# EasyEDA Pro project ProDoc_esp32_DWM1000_2025-11-09.epro

# Schematic Schematic1
Board Name: esp32_DWM1000; Create Date: 2025-10-17; Page Name: P1; Project Name: UWB; Schematic Name: Schematic1; Update Date: 2025-10-17; Company: EasyEDA.com; Page Size: A4; Version: V1.0
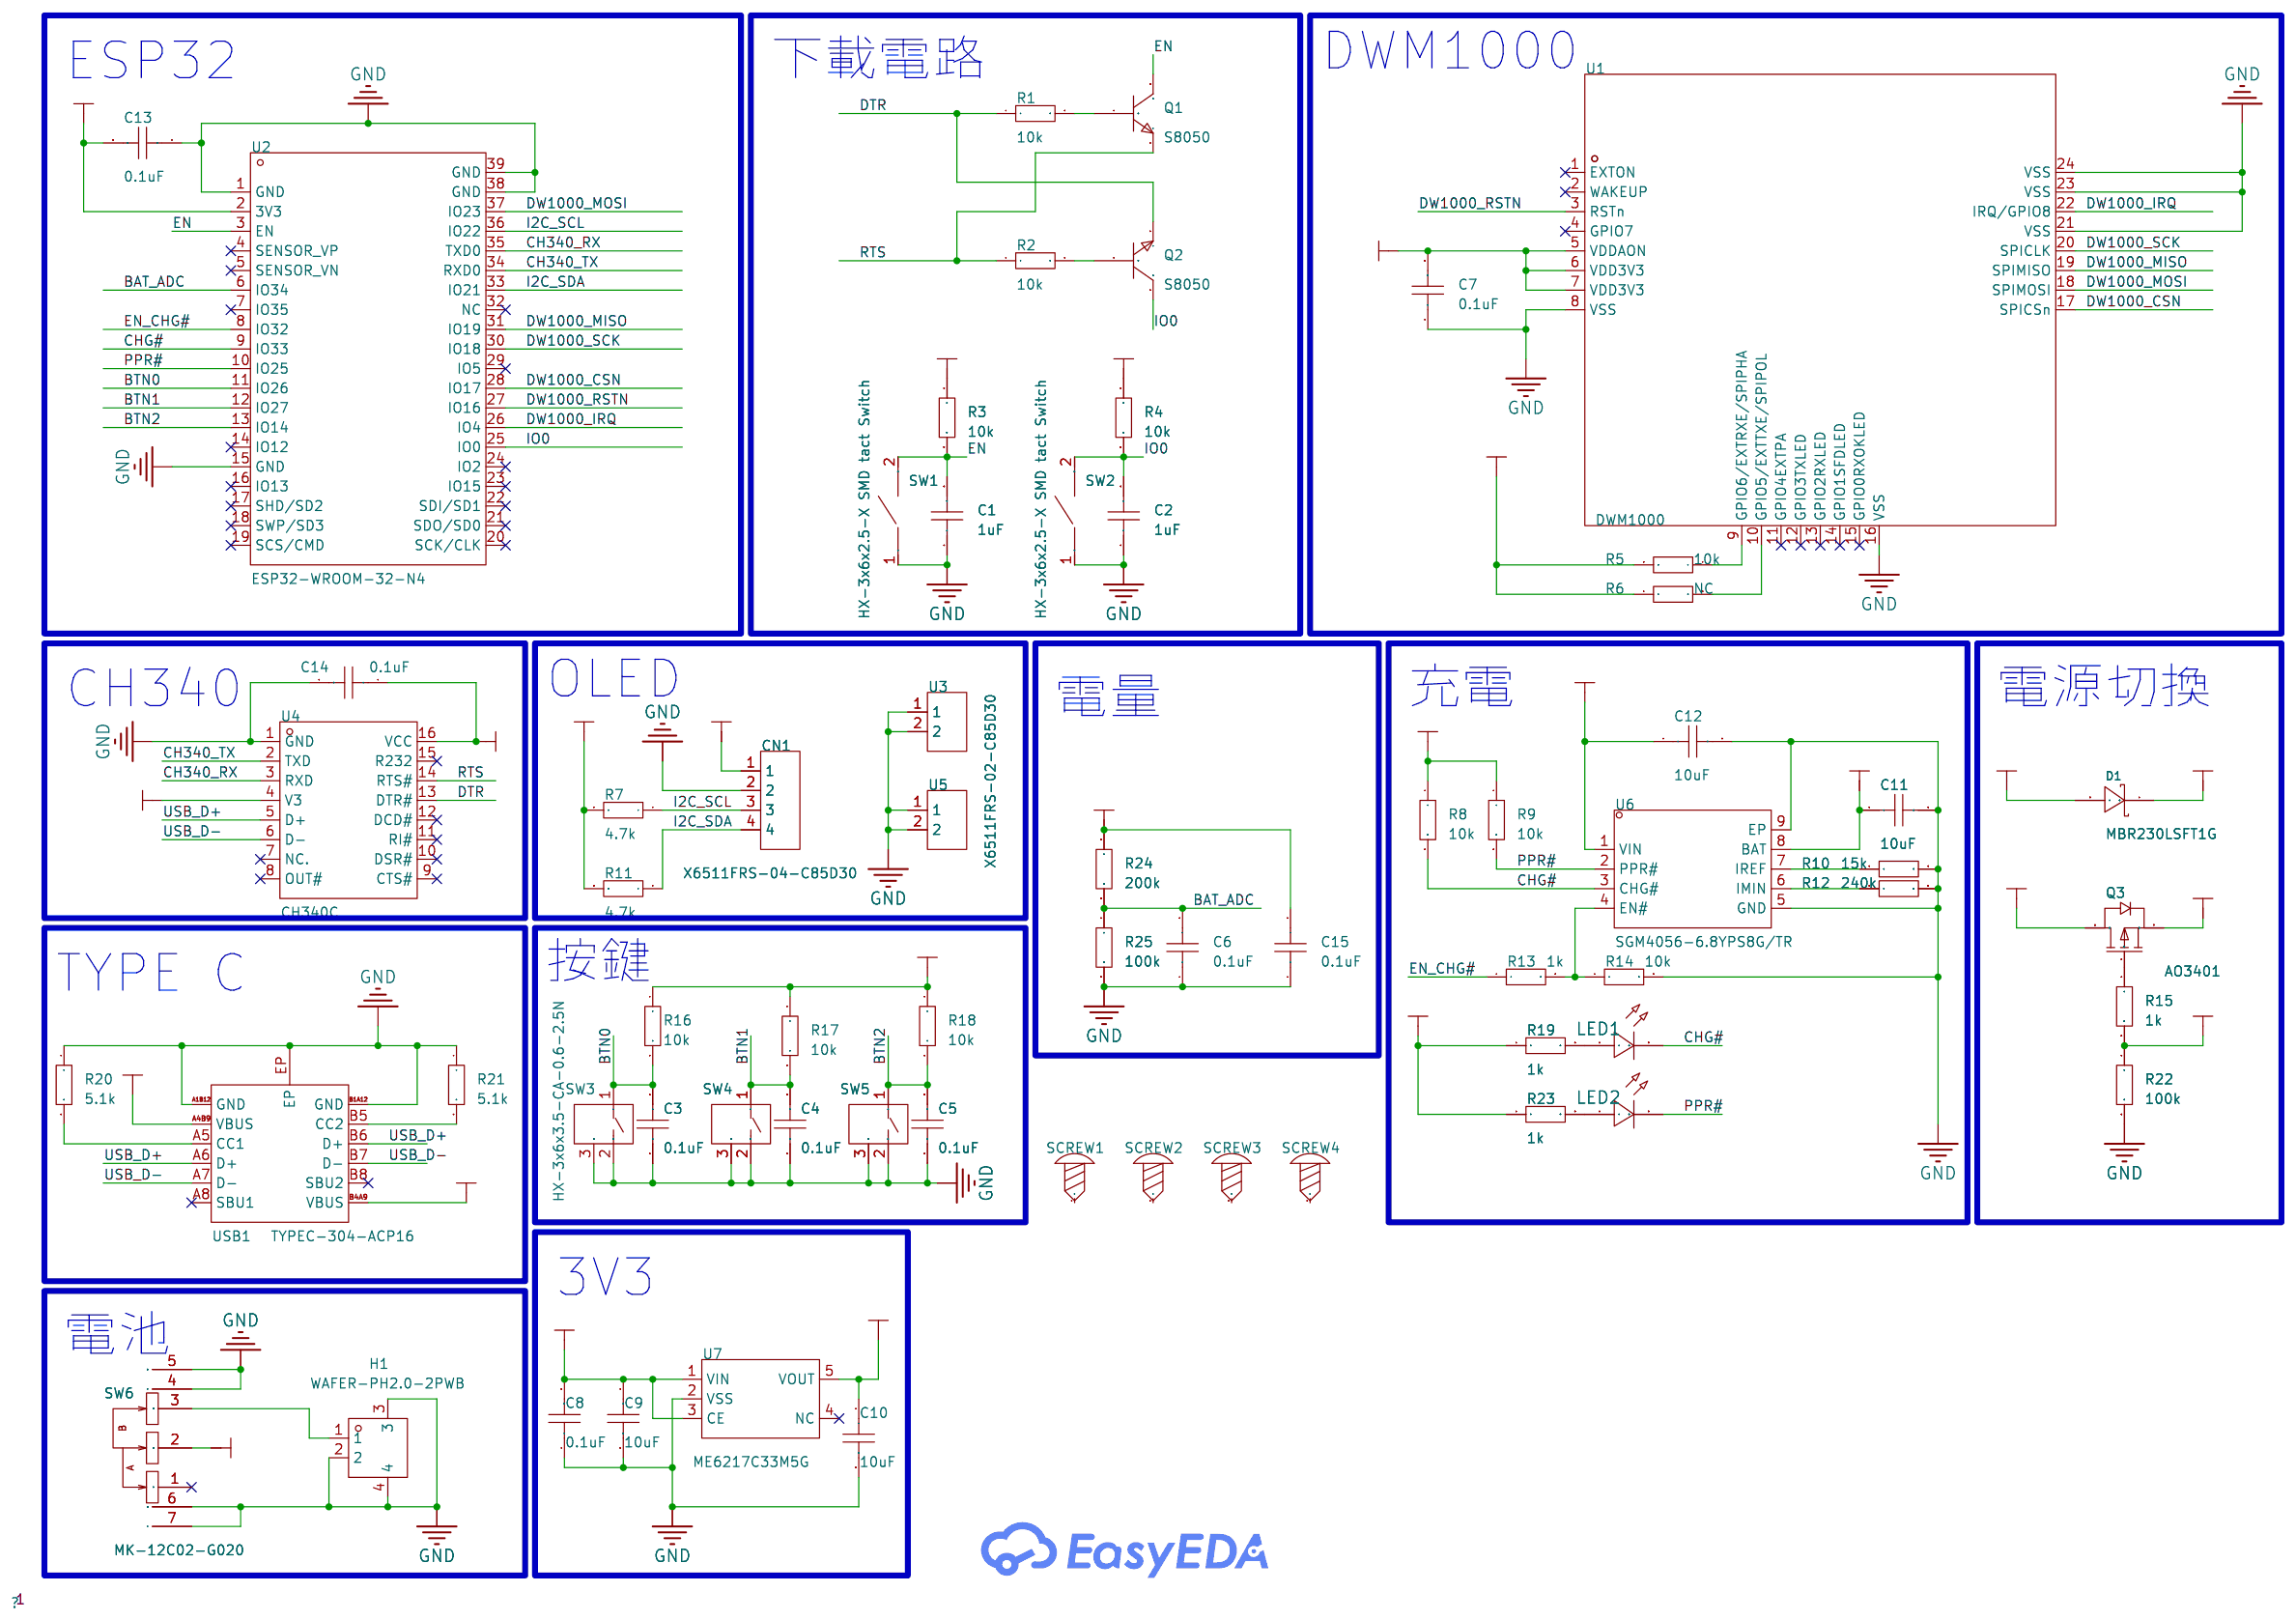
[diagram p0: schematic sheet]

## Parts
C1  1uF  [C0805]
C2  1uF  [C0805]
C3  0.1uF  [C0805]
C4  0.1uF  [C0805]
C5  0.1uF  [C0805]
C6  0.1uF  [C0805]
C7  0.1uF  [C0805]
C8  0.1uF  [C0805]
C9  10uF  [C0805]
C10  10uF  [C0805]
C11  10uF  [C0805]
C12  10uF  [C0805]
C13  0.1uF  [C0805]
C14  0.1uF  [C0805]
C15  0.1uF  [C0805]
CN1  X6511FRS-04-C85D30  [HDR-SMD_4P-P2.54-H-F]
D1  MBR230LSFT1G  [SOD-123FL_L2.7-W1.8-LS3.8-RD]
H1  WAFER-PH2.0-2PWB  [CONN-SMD_2P-P2.00_XUNPU_WAFER-PH2.0-2PWB]
LED1  -  [LED0805-RD_GREEN]
LED2  -  [LED0805-RD_GREEN]
Q1  S8050  [SOT-23-3_L2.9-W1.3-P1.90-LS2.4-BR]
Q2  S8050  [SOT-23-3_L2.9-W1.3-P1.90-LS2.4-BR]
Q3  AO3401  [SOT-23-3_L2.9-W1.6-P1.90-LS2.8-BR]
R1  10k  [R0805]
R2  10k  [R0805]
R3  10k  [R0805]
R4  10k  [R0805]
R5  10k  [R0805]
R6  NC  [R0805]
R7  4.7k  [R0805]
R8  10k  [R0805]
R9  10k  [R0805]
R10  15k  [R0805]
R11  4.7k  [R0805]
R12  240k  [R0805]
R13  1k  [R0805]
R14  10k  [R0805]
R15  1k  [R0805]
R16  10k  [R0805]
R17  10k  [R0805]
R18  10k  [R0805]
R19  1k  [R0805]
R20  5.1k  [R0805]
R21  5.1k  [R0805]
R22  100k  [R0805]
R23  1k  [R0805]
R24  200k  [R0805]
R25  100k  [R0805]
SCREW1  -  [Screw-Hole-M3]
SCREW2  -  [Screw-Hole-M3]
SCREW3  -  [Screw-Hole-M3]
SCREW4  -  [Screw-Hole-M3]
SW1  HX-3x6x2.5-X SMD tact Switch  [SW-SMD_HX-3X6X2.5-X]
SW2  HX-3x6x2.5-X SMD tact Switch  [SW-SMD_HX-3X6X2.5-X]
SW3  HX-3x6x3.5-CA-0.6-2.5N  [SW-SMD_HX-3X6X3.5-CA-0.6-2.5N]
SW4  HX-3x6x3.5-CA-0.6-2.5N  [SW-SMD_HX-3X6X3.5-CA-0.6-2.5N]
SW5  HX-3x6x3.5-CA-0.6-2.5N  [SW-SMD_HX-3X6X3.5-CA-0.6-2.5N]
SW6  MK-12C02-G020  [SW-SMD_MK-12C02-G020]
U1  DWM1000  [WIRELM-TH_DWM1000]
U2  ESP32-WROOM-32-N4  [WIFIM-SMD_ESP32-WROOM-32-N4]
U3  X6511FRS-02-C85D30  [HDR-SMD_2P-P2.54-H-F-L11.5]
U4  CH340C  [SOP-16_L10.0-W3.9-P1.27-LS6.0-BL]
U5  X6511FRS-02-C85D30  [HDR-SMD_2P-P2.54-H-F-L11.5]
U6  SGM4056-6.8YPS8G/TR  [SOIC-8_L4.9-W3.9-P1.27-LS6.0-BL-EP]
U7  ME6217C33M5G  [SOT-23-5_L3.0-W1.7-P0.95-LS2.8-BR]
USB1  TYPEC-304-ACP16  [USB-C-SMD_TYPE-C-16P-1]

## Library data of the parts
C1-C15 = CAP_0805: Supplier Footprint: 0805
CN1 = X6511FRS-04-C85D30: Holes Structure:1x4P Pitch:2.54mm Circular Hole / Square Hole:Square Hole Mounting Type:Surface Mount, Right Angle Number of Rows:1 Number of Positions:4P Current Rating:3A Holes Direction:Side Insulation Height:8.5mm Operating Temperature:-40℃~+105℃ Oper; LCSC Part Name: 1x4P 间距:2.54mm 卧贴; Supplier Part: C5142237; Manufacturer: XKB Connection(中国星坤); Supplier Footprint: SMD,P=2.54mm,卧贴; JLCPCB Part Class: Extended Part; Datasheet: https://item.szlcsc.com/datasheet/X6511FRS-04-C85D30/5758581.html; Supplier: LCSC; Holes Structure: 1x4P; Pitch: 2.54mm; Circular Hole / Square Hole: Square Hole; Mounting Type: Surface Mount, Right Angle; Number of Rows: 1; Number of Positions: 4P; Current Rating: 3A; Holes Direction: Side; Insulation Height: 8.5mm; Operating Temperature: -40℃~+105℃
D1 = MBR230LSFT1G: Voltage - Forward(Vf@If):430mV@2A Voltage - DC Reverse(Vr):30V Current - Rectified:2A Reverse Leakage Current (Ir):1mA@30V Operating Junction Temperature Range:-55℃~+125℃ Operating Junction Temperature Range:-55℃~+125℃ Non-Repetitive Peak Forward Surge Cu; LCSC Part Name: 电压:30V 电流:2A; Supplier Part: C126673; Manufacturer: onsemi(安森美); Supplier Footprint: SOD-123FL; JLCPCB Part Class: 扩展库; Datasheet: https://item.szlcsc.com/datasheet/MBR230LSFT1G/137953.html; Supplier: LCSC; Voltage - Forward(Vf@If): 430mV@2A; Voltage - DC Reverse(Vr): 30V; Current - Rectified: 2A; Reverse Leakage Current (Ir): 1mA@30V; Operating Junction Temperature Range: -55℃~+125℃; Non-Repetitive Peak Forward Surge Current: 40A
H1 = WAFER-PH2.0-2PWB: Pins Structure:1x2P Pitch:2mm Mounting Type:Surface Mount, Right Angle Reference Series:PH Number of Pins:2P Number of Rows:1 Number of PINs Per Row:2 Row Spacing:- Current Rating:2A Contact Material:Brass Contact Plating:Tin Operating Temperature:-25℃~+8; LCSC Part Name: 1x2P 间距:2mm 卧贴 系列:PH; Supplier Part: C3029440; Manufacturer: XUNPU(讯普); Supplier Footprint: SMD,P=2mm,卧贴; JLCPCB Part Class: 扩展库; Datasheet: https://item.szlcsc.com/datasheet/WAFER-PH2.0-2PWB/3561452.html; Supplier: LCSC; Pins Structure: 1x2P; Pitch: 2mm; Mounting Type: Surface Mount, Right Angle; Reference Series: PH; Number of Pins: 2P; Number of Rows: 1; Number of PINs Per Row: 2; Current Rating: 2A; Contact Material: Brass; Contact Plating: Tin; Operating Temperature: -25℃~+85℃; Voltage Rating: 250V; Plastic Material: LCP; Supplementary Features: Auxiliary Solder Pin; Color: Beige; Z-Height of the Board: 5.6mm; X-Length of Bottom Edge on Board (Spacing Line): 8mm; Y-Width of Bottom Edge on Board: 7.59mm
LED1 LED2 = LED_0805-R: Supplier Footprint: 0805
Q1 Q2 = S8050: Transistor Type: Collector Current (Ic): Collector-Emitter Breakdown Voltage (Vceo): Power Dissipation (Pd):; LCSC Part Name: 耐压:25V 电流:500mA NPN; Supplier Part: C139514; Supplier Footprint: SOT-23; JLCPCB Part Class: 扩展库; Datasheet: https://atta.szlcsc.com/upload/public/pdf/source/20171116/C139514_15108221321741123744.pdf; Supplier: LCSC
Q3 = AO3401: Type:1 Piece P-Channel Drain Source Voltage (Vdss): Continuous Drain Current (Id): Drain Source On Resistance (RDS(on)@Vgs,Id):60mΩ@10V,4.2A Power Dissipation (Pd): Gate Threshold Voltage (Vgs(th)@Id): Input Capacitance (Ciss@Vds):957pF@15V Reverse Transf; LCSC Part Name: P沟道,电流:-4.2A,耐压:-30V 停产; Supplier Part: C305433; Manufacturer: BLUE ROCKET(蓝箭); Supplier Footprint: SOT-23; JLCPCB Part Class: 扩展库; Datasheet: https://atta.szlcsc.com/upload/public/pdf/source/20190731/C305433_82C324880901F9A45014693AEB96B6E3.pdf; Supplier: LCSC; Type: 1 Piece P-Channel; Drain Source On Resistance (RDS(on)@Vgs,Id): 60mΩ@10V,4.2A; Input Capacitance (Ciss@Vds): 957pF@15V; Reverse Transfer Capacitance (Crss@Vds): 77pF@15V; Operating Temperature: -55℃~+150℃
R1 R2 R5-R13 R15 R19-R25 = SCR0805F10K: Type:Thick Film Resistor Resistance:10kΩ Tolerance:±1% Tolerance:±1% Power(Watts):125mW Voltage-Supply(Max):150V Operating Temperature:-55℃~+155℃ Operating Temperature:-55℃~+155℃; LCSC Part Name: 厚膜电阻 10kΩ ±1% 125mW; Supplier Part: C3016734; Manufacturer: VO(翔胜); Supplier Footprint: 0805; JLCPCB Part Class: Extended Part; Datasheet: https://atta.szlcsc.com/upload/public/pdf/source/20220513/247AF9639BA21CF93567DC289CCC6A22.pdf; Supplier: LCSC; Type: Thick Film Resistor; Tolerance: ±1%; Power(Watts): 125mW; Voltage-Supply(Max): 150V; Operating Temperature: -55℃~+155℃
R3 R4 R14 R16-R18 = Res_0603: Supplier Footprint: 0603
SCREW1-SCREW4 = Screw-Hole-M3: Supplier Footprint: 插件
SW1 SW2 = HX-3x6x2.5-X SMD tact Switch: LCSC Part Name: 6*3.5*2.5mm 立贴 轻触开关; Supplier Part: C49234125; Manufacturer: hanxia(韩下); Supplier Footprint: SMD; JLCPCB Part Class: 扩展库; Datasheet: https://atta.szlcsc.com/upload/public/pdf/source/20250618/952D7CCB54265932C14FA2108DB7C7AE.pdf; Supplier: LCSC
SW3-SW5 = HX-3x6x3.5-CA-0.6-2.5N: Circuit:SPST Actuator Style:- Operating Force:2.5N Mounting Type:Surface Mount, Right Angle Length:7mm Width:3.55mm Switch Height:3.5mm with Bracket:Without Bracket Contact Current:50mA Voltage Rating:12V Actuator/Cap Color:Black With Lamp:No IP Rating:-; LCSC Part Name: 7.7*3.5*3.5mm 卧贴 轻触开关; Supplier Part: C49234146; Manufacturer: hanxia(韩下); Supplier Footprint: SMD,7x3.6mm; JLCPCB Part Class: 扩展库; Datasheet: https://item.szlcsc.com/datasheet/HX-3x6x3.5-CA-0.6-2.5N/51650207.html; Supplier: LCSC; Circuit: SPST; Operating Force: 2.5N; Mounting Type: Surface Mount, Right Angle; Length: 7mm; Width: 3.55mm; Switch Height: 3.5mm; with Bracket: Without Bracket; Contact Current: 50mA; Voltage Rating: 12V; Actuator/Cap Color: Black; With Lamp: No; Termination Style: SMD(SMT) Tab; Life: 20,000 Cycles
SW6 = MK-12C02-G020: Circuit:SPDT Actuator Style:Rectangular Columnar Termination Style:- Length:6.6mm Width:1.4mm Switch Height:4.7mm Mounting Type:Surface Mount, Right Angle Actuator Color:Black Current Rating:1A Voltage Rating:6V Life:10,000 Cycles Operating Temperature:-2; LCSC Part Name: 微型拨动开关; Supplier Part: C963206; Manufacturer: G-Switch(品赞); Supplier Footprint: SMD,6.6x1.4mm; Datasheet: https://item.szlcsc.com/datasheet/MK-12C02-G020/1046841.html; Supplier: LCSC; Circuit: SPDT; Actuator Style: Rectangular Columnar; Length: 6.6mm; Width: 1.4mm; Switch Height: 4.7mm; Mounting Type: Surface Mount, Right Angle; Actuator Color: Black; Current Rating: 1A; Voltage Rating: 6V; Life: 10,000 Cycles; Operating Temperature: -20℃~+70℃
U1 = DWM1000: Supplier Part: C95238; Manufacturer: decaWave; Supplier Footprint: SMD; JLCPCB Part Class: 扩展库; Datasheet: https://atta.szlcsc.com/upload/public/pdf/source/20170217/1487301595210.pdf; Supplier: LCSC
U2 = ESP32-WROOM-32-N4: LCSC Part Name: WiFi+蓝牙4.2+双核CPU模块; Supplier Part: C82899; Manufacturer: ESPRESSIF(乐鑫); Supplier Footprint: SMD,25.5x18mm; JLCPCB Part Class: 扩展库; Datasheet: https://item.szlcsc.com/datasheet/ESP32-WROOM-32-N4/84060.html; Supplier: LCSC
U3 U5 = X6511FRS-02-C85D30: Holes Structure:1x2P Pitch:2.54mm Circular Hole / Square Hole:Square Hole Mounting Type:Surface Mount, Right Angle Number of Rows:1 Number of Positions:2P Current Rating:3A Holes Direction:Side Insulation Height:8.5mm Operating Temperature:-40℃~+105℃ Oper; LCSC Part Name: 1x2P 间距:2.54mm 卧贴; Supplier Part: C5142235; Manufacturer: XKB Connection(中国星坤); Supplier Footprint: SMD,P=2.54mm,卧贴; JLCPCB Part Class: 扩展库; Datasheet: https://item.szlcsc.com/datasheet/X6511FRS-02-C85D30/5758579.html; Supplier: LCSC; Holes Structure: 1x2P; Pitch: 2.54mm; Circular Hole / Square Hole: Square Hole; Mounting Type: Surface Mount, Right Angle; Number of Rows: 1; Number of Positions: 2P; Current Rating: 3A; Holes Direction: Side; Insulation Height: 8.5mm; Operating Temperature: -40℃~+105℃
U4 = CH340C: Applications Function:Transceiver USB Protocol:USB 2.0 Voltage - Supply:3.3V；5V Voltage - Supply:3.3V；5V Data Rate:2Mbps Operating Temperature:-20℃~+70℃ Operating Temperature:-20℃~+70℃ Current - Supply:7mA Supply Current (Iq):50uA; LCSC Part Name: USB转串口芯片; Supplier Part: C84681; Manufacturer: WCH(南京沁恒); Supplier Footprint: SOP-16; Datasheet: https://item.szlcsc.com/datasheet/CH340C/85852.html; Supplier: LCSC; Applications Function: Transceiver; USB Protocol: USB 2.0; Voltage - Supply: 3.3V；5V; Data Rate: 2Mbps; Operating Temperature: -20℃~+70℃; Current - Supply: 7mA; Supply Current (Iq): 50uA
U6 = SGM4056-6.8YPS8G/TR: Supplier Part: C79687; Manufacturer: SGMICRO(圣邦微); Supplier Footprint: SOIC-8-EP; JLCPCB Part Class: 扩展库; Datasheet: https://atta.szlcsc.com/upload/public/pdf/source/20170908/C79687_1504870102874958054.pdf; Supplier: LCSC
U7 = ME6217C33M5G: Output Type:Fixed Voltage - Supply:6.5V Output Voltage:3.3V Output Voltage:3.3V Output Current:800mA Power Supply Rejection Ratio (PSRR):65dB@(1kHz) Voltage Dropout:180mV@(300mA) standby current:100uA Features:Over Temperature Protection；Enable Operating; LCSC Part Name: 输入7V 输出3.3V 800mA; Supplier Part: C427602; Manufacturer: MICRONE(南京微盟); Supplier Footprint: SOT-23-5; Datasheet: https://item.szlcsc.com/datasheet/ME6217C33M5G/421842.html; Supplier: LCSC; Output Type: Fixed; Voltage - Supply: 6.5V; Output Voltage: 3.3V; Output Current: 800mA; Power Supply Rejection Ratio (PSRR): 65dB@(1kHz); Voltage Dropout: 180mV@(300mA); standby current: 100uA; Features: Over Temperature Protection；Enable; Operating Temperature: -40℃~+85℃; Output Configuration: Positive; Number of Outputs: 1
USB1 = TYPEC-304-ACP16: Connector Type:Type-C Standard:- Gender:Female Number of Ports:1 Number of Contacts:16P Mounting Style:卧贴 Current Rating - Power (Max):3A Contact Material:Copper Contact Plating:Gold Operating Temperature Range:-40℃~+85℃ Operating Temperature Range:-40℃~+; LCSC Part Name: Type-C 母 卧贴; Supplier Part: C2982555; Manufacturer: XUNPU(讯普); Supplier Footprint: SMD; Datasheet: https://atta.szlcsc.com/upload/public/pdf/source/20220311/3C907F75E12F45E4EE7F73565AB9C294.pdf; Supplier: LCSC; Connector Type: Type-C; Gender: Female; Number of Ports: 1; Number of Contacts: 16P; Mounting Style: 卧贴; Current Rating - Power (Max): 3A; Contact Material: Copper; Contact Plating: Gold; Operating Temperature Range: -40℃~+85℃

## Nets
3V3: C7.2 C10.1 C13.2 C14.1 CN1.1 R3.1 R4.1 R5.2 R6.1 R7.2 R8.1 R9.1 R11.2 R16.1 R17.1 R18.1 R19.1 R23.1 U1.5(VDDAON) U1.6(VDD3V3) U1.7(VDD3V3) U2.2(3V3) U4.4(V3) U4.16(VCC) U7.5(VOUT)
5V: C12.1 D1.2(A) R15.2 R22.1 U6.1(VIN) USB1.A4B9(VBUS) USB1.B4A9(VBUS)
GND: C1.1 C2.1 C3.1 C4.1 C5.1 C6.1 C7.1 C8.1 C9.2 C10.2 C11.2 C12.2 C13.1 C14.2 C15.1 CN1.2 H1.2 H1.3 H1.4 R10.2 R12.2 R14.2 R20.1 R21.1 R22.2 R25.2 SW1.1 SW2.1 SW3.2 SW3.3 SW4.2 SW4.3 SW5.2 SW5.3 SW6.4 SW6.5 SW6.6 SW6.7 U1.8(VSS) U1.16(VSS) U1.21(VSS) U1.23(VSS) U1.24(VSS) U2.1(GND) U2.15(GND) U2.38(GND) U2.39(GND) U3.1 U3.2 U4.1(GND) U5.1 U5.2 U6.5(GND) U6.9(EP) U7.2(VSS) USB1.A1B12(GND) USB1.B1A12(GND) USB1.EP
VBAT: C11.1 C15.2 Q3.3(D) R24.1 SW6.2 U6.8(BAT)
BAT_ADC: C6.2 R24.2 R25.1 U2.6(IO34)
BTN0: C3.2 R16.2 SW3.1 U2.11(IO26)
BTN1: C4.2 R17.2 SW4.1 U2.12(IO27)
BTN2: C5.2 R18.2 SW5.1 U2.13(IO14)
CH340_RX: U2.35(TXD0) U4.3(RXD)
CH340_TX: U2.34(RXD0) U4.2(TXD)
CHG#: LED1.2(C) R8.2 U2.9(IO33) U6.3(CHG#)
DTR: Q2.2(E) R1.1 U4.13(DTR#)
DW1000_CSN: U1.17(SPICSn) U2.28(IO17)
DW1000_IRQ: U1.22(IRQ/GPIO8) U2.26(IO4)
DW1000_MISO: U1.19(SPIMISO) U2.31(IO19)
DW1000_MOSI: U1.18(SPIMOSI) U2.37(IO23)
DW1000_RSTN: U1.3(RSTn) U2.27(IO16)
DW1000_SCK: U1.20(SPICLK) U2.30(IO18)
EN: C1.2 Q1.3(C) R3.2 SW1.2 U2.3(EN)
EN_CHG#: R13.1 U2.8(IO32)
I2C_SCL: CN1.3 R7.1 U2.36(IO22)
I2C_SDA: CN1.4 R11.1 U2.33(IO21)
IO0: C2.2 Q2.3(C) R4.2 SW2.2 U2.25(IO0)
PPR#: LED2.2(C) R9.2 U2.10(IO25) U6.2(PPR#)
RTS: Q1.2(E) R2.1 U4.14(RTS#)
USB_D+: U4.5(D+) USB1.A6(D+) USB1.B6(D+)
USB_D-: U4.6(D-) USB1.A7(D-) USB1.B7(D-)
VSYS: C8.2 C9.1 D1.1(C) Q3.2(S) U7.1(VIN) U7.3(CE)
$1N1272: Q1.1(B) R1.2
$1N1274: Q2.1(B) R2.2
$1N2137: R20.2 USB1.A5(CC1)
$1N2147: R21.2 USB1.B5(CC2)
$1N2753: R5.1 U1.9(GPIO6/EXTRXE/SPIPHA)
$1N2758: R6.2 U1.10(GPIO5/EXTTXE/SPIPOL)
$1N3652: Q3.1(G) R15.1
$1N4219: R10.1 U6.7(IREF)
$1N4263: R12.1 U6.6(IMIN)
$1N4572: LED2.1(A) R23.2
$1N4597: LED1.1(A) R19.2
$1N4717: R13.2 R14.1 U6.4(EN#)
$1N5038: H1.1 SW6.3

Not connected (* = marked no-connect by the designer): SCREW1 1; SCREW2 1; SCREW3 1; SCREW4 1; SW6 1*; U1 1(EXTON)* 2(WAKEUP)* 4(GPIO7)* 11(GPIO4EXTPA)* 12(GPIO3TXLED)* 13(GPIO2RXLED)* 14(GPIO1SFDLED)* 15(GPIO0RXOKLED)*; U2 4(SENSOR_VP)* 5(SENSOR_VN)* 7(IO35)* 14(IO12)* 16(IO13)* 17(SHD/SD2)* 18(SWP/SD3)* 19(SCS/CMD)* 20(SCK/CLK)* 21(SDO/SD0)* 22(SDI/SD1)* 23(IO15)* 24(IO2)* 29(IO5)* 32(NC)*; U4 7(NC.)* 8(OUT#)* 9(CTS#)* 10(DSR#)* 11(RI#)* 12(DCD#)* 15(R232)*; U7 4(NC)*; USB1 A8(SBU1)* B8(SBU2)*

## Notes on the sheet
- ESP32
- 下載電路
- DWM1000
- CH340
- OLED
- 電量
- 充電
- 電源切換
- TYPE C
- 按鍵
- 3V3
- 電池

# Board esp32_DWM1000_V1
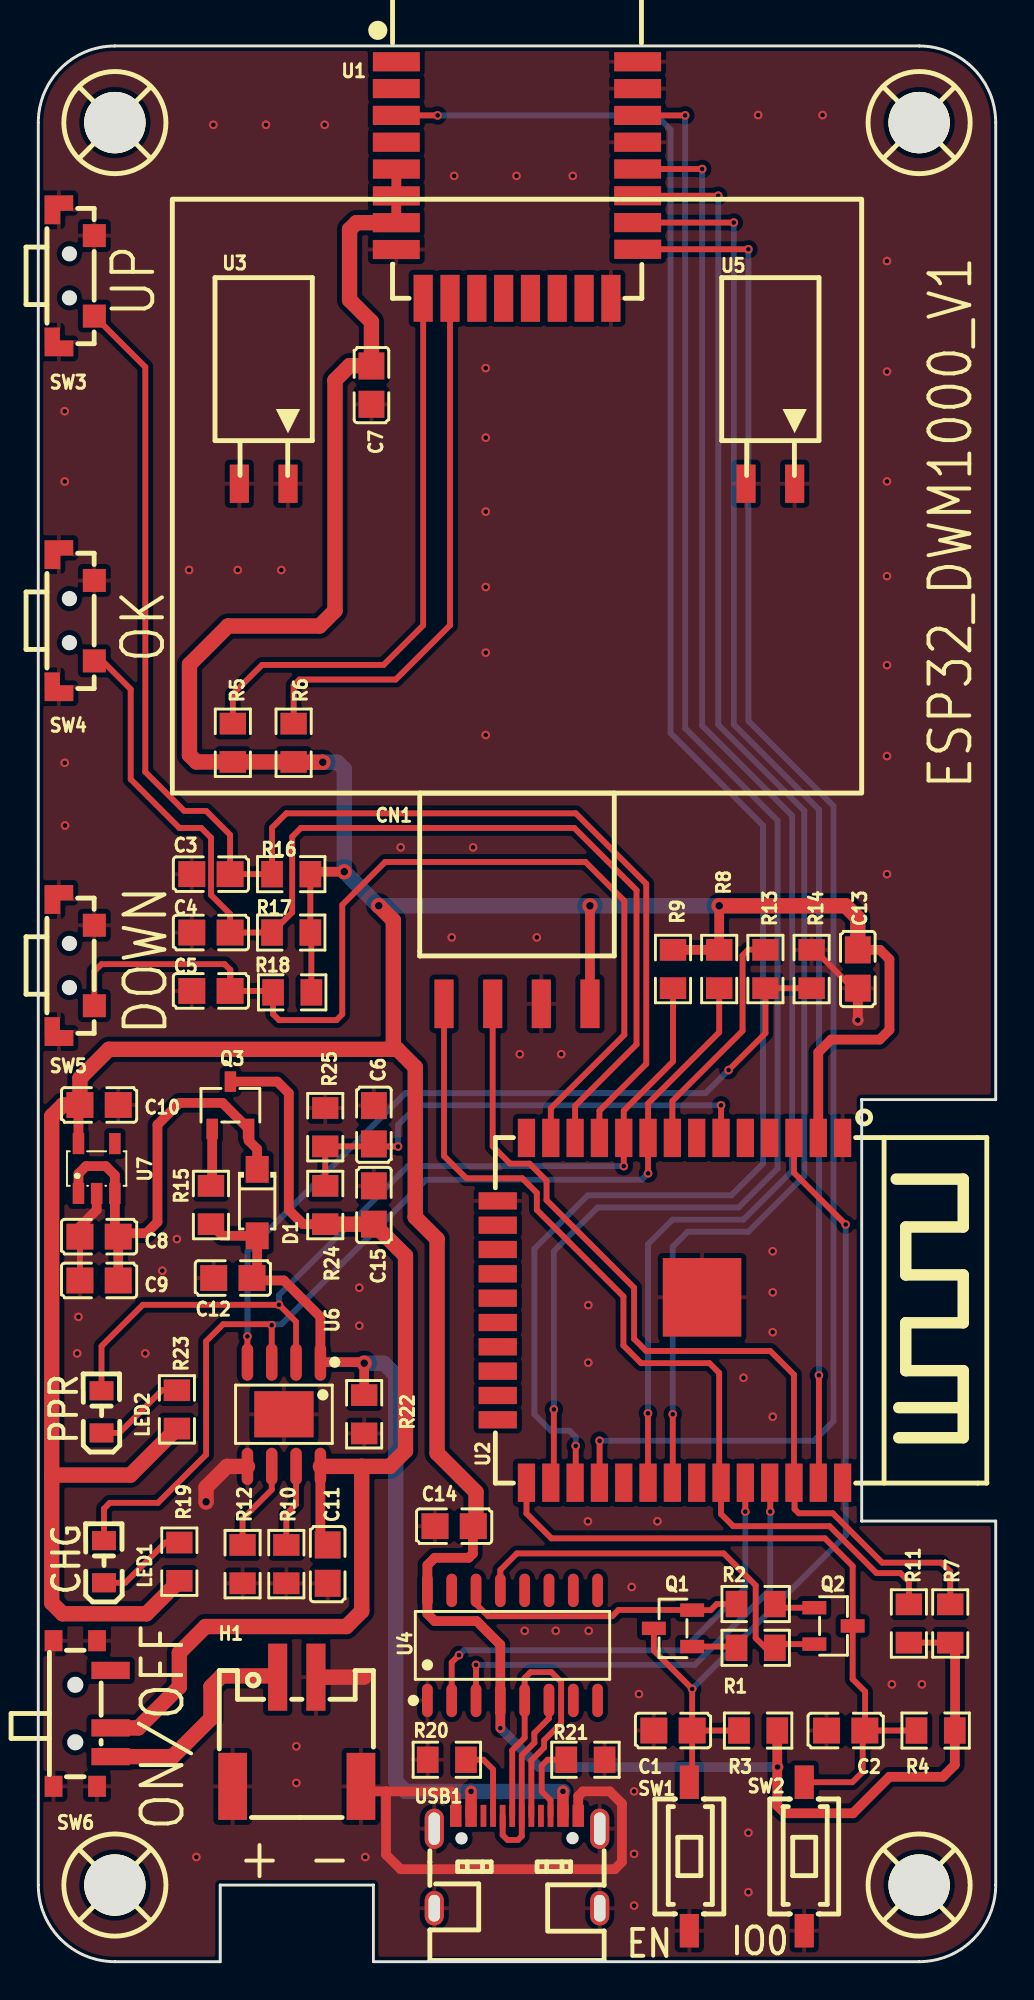
[diagram p1: board, top side]
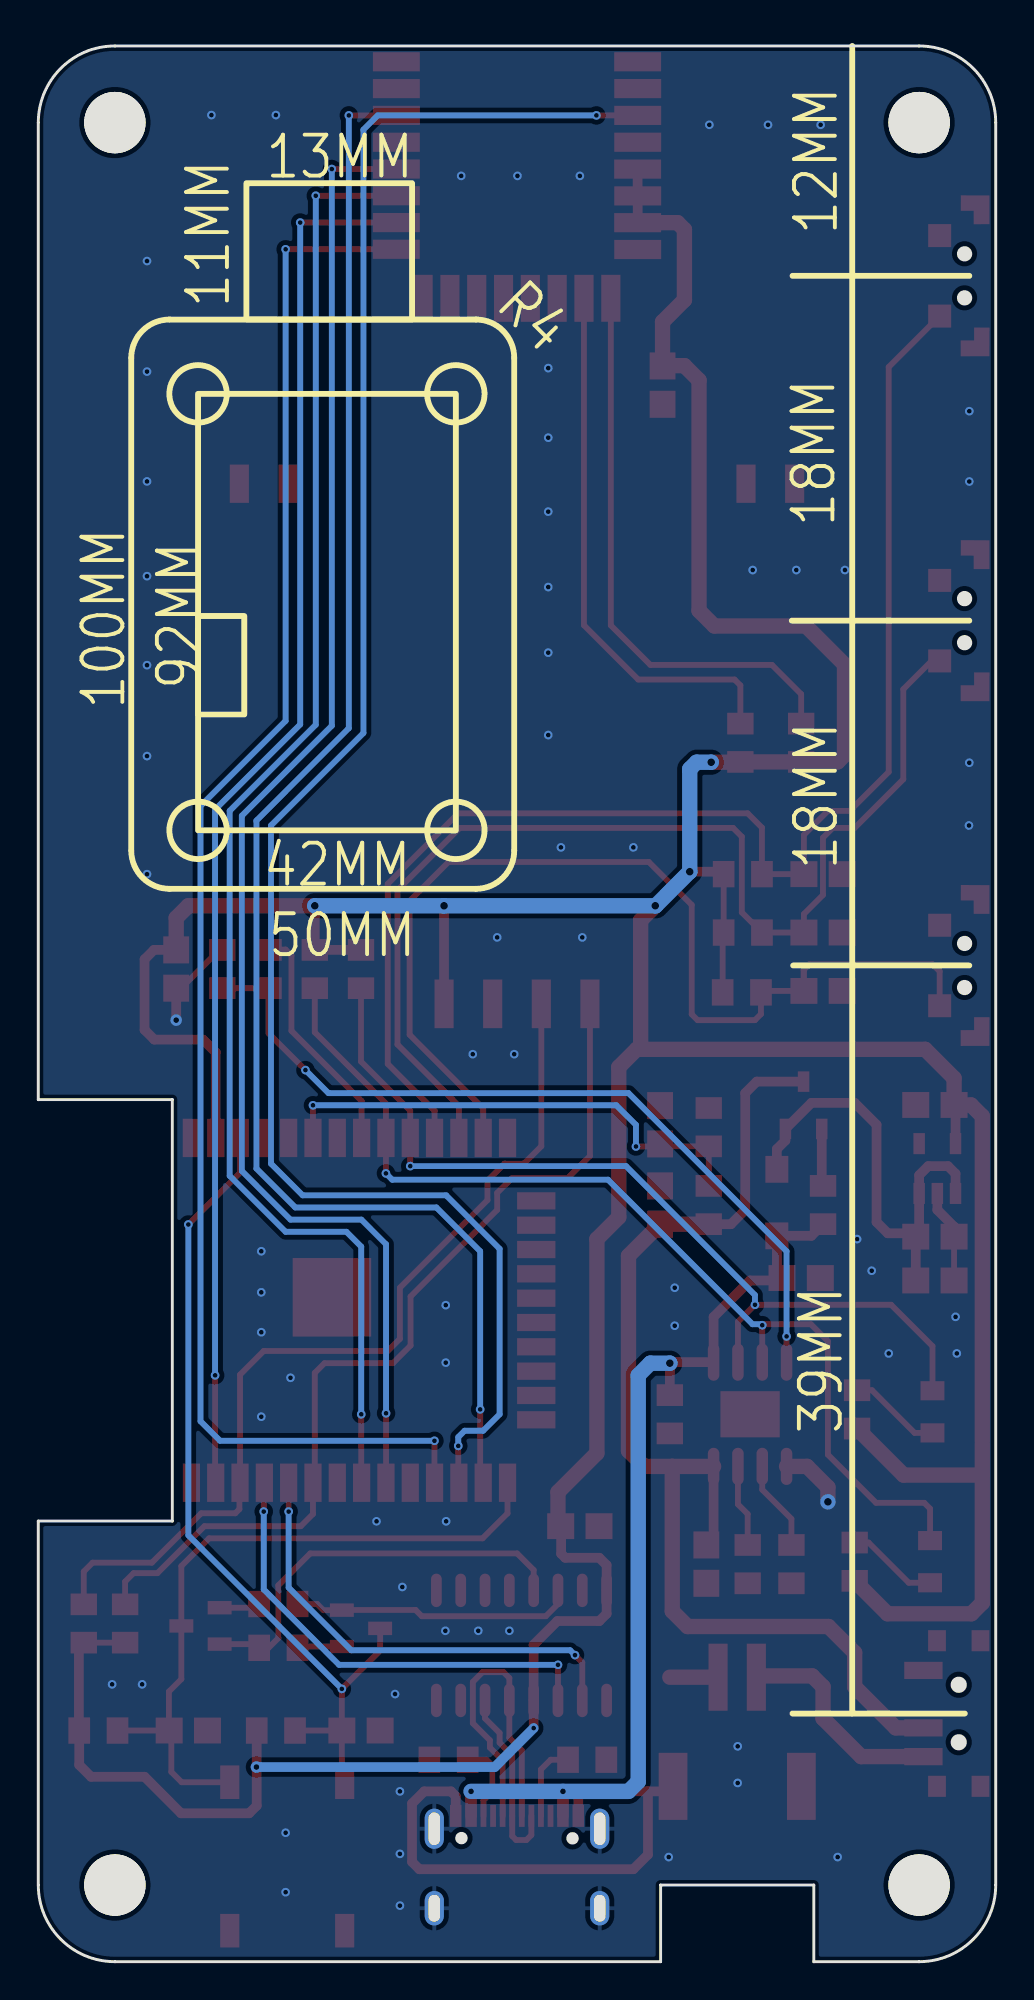
[diagram p2: board, bottom side, seen from below]

Outline 50 x 100 mm; copper layers: Top Layer, Bottom Layer. Coordinates in mm from the lower left corner of the outline.
Outline path: 0,96 0,4 arc(1.17,1.17) 4,0 9.5,0 9.5,4 17.5,4 17.5,0 46,0 arc(48.83,1.17) 50,4 50,23 43,23 43,45 50,45 50,96 arc(48.83,98.83) 46,100 4,100 arc(1.17,98.83) 0,96
Stack: Top Layer 0.035mm / Dielectric1 1.51mm FR4 er 4.5 / Bottom Layer 0.035mm

## Design rules (mm)
template: 二層板預設
spacing copperThickness1oz (default): track to track 0.102, other pairs 0.102 to 0.3
spacing copperThickness2oz: track to track 0.203, other pairs 0.152 to 0.3
track width copperThickness1oz (default): min 0.127, default 0.305, max 2.54
track width copperThickness2oz: min 0.203, default 0.254, max 2.54
differential pair differentialPair (default): width min 0.127, default 0.152, max 2.54; gap min 0.152, default 0.152
via viaSize (default): diameter min 0.25, default 0.45, max 10; hole min 0.15, default 0.25, max 6.3

## Placement (name value [footprint] x y rotation side)
C1  1uF  [C0805]  33.15 12.06 0 top
C2  1uF  [C0805]  42.16 12.06 0 top
C3  0.1uF  [C0805]  9.02 56.77 0 top
C4  0.1uF  [C0805]  9.02 53.72 0 top
C5  0.1uF  [C0805]  9.02 50.67 0 top
C6  0.1uF  [C0805]  17.53 43.69 270 top
C7  0.1uF  [C0805]  17.4 82.3 90 top
C8  0.1uF  [C0805]  3.17 37.85 0 top
C9  10uF  [C0805]  3.17 35.56 180 top
C10  10uF  [C0805]  3.17 44.72 0 top
C11  10uF  [C0805]  15.11 20.75 270 top
C12  10uF  [C0805]  10.16 35.69 180 top
C13  0.1uF  [C0805]  42.8 51.82 90 top
C14  0.1uF  [C0805]  21.72 22.73 180 top
C15  0.1uF  [C0805]  17.53 39.5 270 top
CN1  X6511FRS-04-C85D30  [HDR-SMD_4P-P2.54-H-F]  25 50 180 top
D1  MBR230LSFT1G  [SOD-123FL_L2.7-W1.8-LS3.8-RD]  11.43 39.62 270 top
H1  WAFER-PH2.0-2PWB  [CONN-SMD_2P-P2.00_XUNPU_WAFER-PH2.0-2PWB]  13.5 12 0 top
LED1  -  [LED0805-RD_GREEN]  3.43 20.88 90 top
LED2  -  [LED0805-RD_GREEN]  3.3 28.7 90 top
Q1  S8050  [SOT-23-3_L2.9-W1.3-P1.90-LS2.4-BR]  33.15 17.4 0 top
Q2  S8050  [SOT-23-3_L2.9-W1.3-P1.90-LS2.4-BR]  41.53 17.53 180 top
Q3  AO3401  [SOT-23-3_L2.9-W1.6-P1.90-LS2.8-BR]  10.03 44.7 270 top
R1  10k  [R0805]  37.47 16.38 180 top
R2  10k  [R0805]  37.47 18.67 0 top
R3  10k  [R0805]  37.59 12.06 180 top
R4  10k  [R0805]  46.86 12.06 180 top
R5  10k  [R0805]  10.16 63.63 270 top
R6  NC  [R0805]  13.34 63.63 90 top
R7  4.7k  [R0805]  47.62 17.65 270 top
R8  10k  [R0805]  35.56 51.82 270 top
R9  10k  [R0805]  33.15 51.82 270 top
R10  15k  [R0805]  12.95 20.75 270 top
R11  4.7k  [R0805]  45.47 17.65 270 top
R12  240k  [R0805]  10.67 20.75 270 top
R13  1k  [R0805]  37.97 51.82 270 top
R14  10k  [R0805]  40.39 51.82 90 top
R15  1k  [R0805]  9.02 39.5 270 top
R16  10k  [R0805]  13.21 56.77 180 top
R17  10k  [R0805]  13.21 53.72 180 top
R18  10k  [R0805]  13.26 50.6 180 top
R19  1k  [R0805]  7.37 20.88 90 top
R20  5.1k  [R0805]  21.34 10.54 0 top
R21  5.1k  [R0805]  28.57 10.54 180 top
R22  100k  [R0805]  17.02 28.57 270 top
R23  1k  [R0805]  7.24 28.83 90 top
R24  200k  [R0805]  14.99 39.5 90 top
R25  100k  [R0805]  14.99 43.56 90 top
SCREW1  -  [Screw-Hole-M3]  4 96 0 top
SCREW2  -  [Screw-Hole-M3]  46 96 0 top
SCREW3  -  [Screw-Hole-M3]  4 4 0 top
SCREW4  -  [Screw-Hole-M3]  46 4 0 top
SW1  HX-3x6x2.5-X SMD tact Switch  [SW-SMD_HX-3X6X2.5-X]  34 5.49 90 top
SW2  HX-3x6x2.5-X SMD tact Switch  [SW-SMD_HX-3X6X2.5-X]  40 5.49 90 top
SW3  HX-3x6x3.5-CA-0.6-2.5N  [SW-SMD_HX-3X6X3.5-CA-0.6-2.5N]  2 88 90 top
SW4  HX-3x6x3.5-CA-0.6-2.5N  [SW-SMD_HX-3X6X3.5-CA-0.6-2.5N]  2 70 90 top
SW5  HX-3x6x3.5-CA-0.6-2.5N  [SW-SMD_HX-3X6X3.5-CA-0.6-2.5N]  2 52 90 top
SW6  MK-12C02-G020  [SW-SMD_MK-12C02-G020]  2.29 12.95 270 top
U1  DWM1000  [WIRELM-TH_DWM1000]  25 93 0 top
U2  ESP32-WROOM-32-N4  [WIFIM-SMD_ESP32-WROOM-32-N4]  33 34 270 top
U3  X6511FRS-02-C85D30  [HDR-SMD_2P-P2.54-H-F-L11.5]  11.77 77.15 180 top
U4  CH340C  [SOP-16_L10.0-W3.9-P1.27-LS6.0-BL]  24.76 16.51 0 top
U5  X6511FRS-02-C85D30  [HDR-SMD_2P-P2.54-H-F-L11.5]  38.23 77.15 180 top
U6  SGM4056-6.8YPS8G/TR  [SOIC-8_L4.9-W3.9-P1.27-LS6.0-BL-EP]  12.83 28.57 180 top
U7  ME6217C33M5G  [SOT-23-5_L3.0-W1.7-P0.95-LS2.8-BR]  3.05 41.4 270 top
USB1  TYPEC-304-ACP16  [USB-C-SMD_TYPE-C-16P-1]  25 5.2 0 top

## Footprints (pads in the part's own frame, mm; a bottom-side part is the same pattern mirrored in y, then rotated)
C0805
  rect 1.41x1.35 smd: 1(-1,0) 2(1,0)
CONN-SMD_2P-P2.00_XUNPU_WAFER-PH2.0-2PWB
  rect 1x3.5 smd: 1(-1,2.85) 2(1,2.85)
  rect 1.5x3.5 smd: 3(-3.35,-2.85) 4(3.35,-2.85)
HDR-SMD_2P-P2.54-H-F-L11.5
  rect 1x2 smd: 1(-1.27,0) 2(1.27,0)
HDR-SMD_4P-P2.54-H-F
  rect 1x2.54 smd: 1(-3.81,0) 2(-1.27,0) 3(1.27,0) 4(3.81,0)
LED0805-RD_GREEN
  rect 1x1.25 smd: 1(-1.1,0) 2(1.1,0)
R0805
  rect 1.133x1.377 smd: 1(-1,0) 2(1,0)
Screw-Hole-M3
  round 3.2 hole 3.2: 1(0,0)
SOD-123FL_L2.7-W1.8-LS3.8-RD
  rect 1.4x1.2 smd: 1(-1.735,0) 2(1.735,0)
SOIC-8_L4.9-W3.9-P1.27-LS6.0-BL-EP
  oval 0.602x1.941 smd: 1(-1.905,-2.72) 2(-0.635,-2.72) 3(0.635,-2.72) 4(1.905,-2.72) 5(1.905,2.72) 6(0.635,2.72) 7(-0.635,2.72) 8(-1.905,2.72)
  rect 3.098x2.41 smd: 9(0,0)
SOP-16_L10.0-W3.9-P1.27-LS6.0-BL
  oval 0.56x1.745 smd: 1(-4.445,-2.873) 2(-3.175,-2.873) 3(-1.905,-2.873) 4(-0.635,-2.873) 5(0.635,-2.873) 6(1.905,-2.873) 7(3.175,-2.873) 8(4.445,-2.873) 9(4.445,2.873) 10(3.175,2.873) 11(1.905,2.873) 12(0.635,2.873) 13(-0.635,2.873) 14(-1.905,2.873) 15(-3.175,2.873) 16(-4.445,2.873)
SOT-23-3_L2.9-W1.3-P1.90-LS2.4-BR
  rect 1.25x0.7 smd: 1(1,-0.95) 2(1,0.95) 3(-1,0)
SOT-23-3_L2.9-W1.6-P1.90-LS2.8-BR
  rect 1.07x0.6 smd: 1(1.235,-0.95) 2(1.235,0.95) 3(-1.235,0)
SOT-23-5_L3.0-W1.7-P0.95-LS2.8-BR
  rect 1.1x0.6 smd: 1(1.3,-0.95) 2(1.3,0) 3(1.3,0.95) 4(-1.3,0.95) 5(-1.3,-0.95)
SW-SMD_HX-3X6X2.5-X
  rect 1.75x1 smd: 1(-3.875,0) 2(3.875,0)
SW-SMD_HX-3X6X3.5-CA-0.6-2.5N
  rect 1.2x1.2 smd: 1(-2.099,-0.926) 2(2.101,-0.926)
  custom 1.501x1.509 smd: 3(-3.449,0.924)
  custom 1.509x1.501 smd: 3(3.449,0.926)
SW-SMD_MK-12C02-G020
  rect 0.9x2 smd: 1(-2.25,1.49) 2(0.75,1.49) 3(2.25,1.49)
  rect 1.1x0.93 smd: 4(3.8,0.779) 5(3.8,-1.49) 6(-3.8,-1.49) 7(-3.8,0.779)
USB-C-SMD_TYPE-C-16P-1
  rect 0.6x1.15 smd: A1B12(-3.2,2.41) A4B9(-2.4,2.41) B1A12(3.2,2.41) B4A9(2.4,2.41)
  rect 0.3x1.15 smd: A5(-1.25,2.41) A6(-0.25,2.41) A7(0.25,2.41) A8(1.25,2.41) B5(1.75,2.41) B6(0.75,2.41) B7(-0.75,2.41) B8(-1.75,2.41)
  oval 1x2.1 hole 0.6x1.7: EP(-4.32,1.74) EP(4.32,1.74)
  oval 1x1.8 hole 0.6x1.4: EP(-4.32,-2.41) EP(4.32,-2.41)
WIFIM-SMD_ESP32-WROOM-32-N4
  rect 2x0.9 smd: 1(-9,9.005) 2(-9,7.735) 3(-9,6.465) 4(-9,5.195) 5(-9,3.925) 6(-9,2.655) 7(-9,1.385) 8(-9,0.115) 9(-9,-1.155) 10(-9,-2.425) 11(-9,-3.695) 12(-9,-4.965) 13(-9,-6.235) 14(-9,-7.505) 25(9,-7.505) 26(9,-6.235) 27(9,-4.965) 28(9,-3.695) 29(9,-2.425) 30(9,-1.155) 31(9,0.115) 32(9,1.385) 33(9,2.655) 34(9,3.925) 35(9,5.195) 36(9,6.465) 37(9,7.735) 38(9,9.005)
  rect 0.9x2 smd: 15(-5.715,-9.005) 16(-4.445,-9.005) 17(-3.175,-9.005) 18(-1.905,-9.005) 19(-0.635,-9.005) 20(0.635,-9.005) 21(1.905,-9.005) 22(3.175,-9.005) 23(4.445,-9.005) 24(5.715,-9.005)
  rect 4.1x4.1 smd: 39(-0.68,1.665)
WIRELM-TH_DWM1000
  rect 2.45x1 smd: 1(-6.301,6.175) 2(-6.303,4.776) 3(-6.304,3.376) 4(-6.303,1.976) 5(-6.3,0.574) 6(-6.303,-0.827) 7(-6.301,-2.224) 8(-6.303,-3.625) 17(6.304,-3.613) 18(6.301,-2.218) 19(6.3,-0.818) 20(6.301,0.576) 21(6.3,1.974) 22(6.298,3.374) 23(6.301,4.774) 24(6.301,6.175)
  rect 1x2.45 smd: 9(-4.901,-6.17) 10(-3.497,-6.173) 11(-2.097,-6.175) 12(-0.697,-6.175) 13(0.703,-6.175) 14(2.103,-6.175) 15(3.503,-6.175) 16(4.903,-6.173)

## Nets
As in the schematic.

Pads without a net: SCREW1 1; SCREW2 1; SCREW3 1; SCREW4 1; SW6 1; U1 1 2 4 11 12 13 14 15; U2 4 5 7 14 16 17 18 19 20 21 22 23 24 29 32; U4 7 8 9 10 11 12 15; U7 4; USB1 A8 B8

## Via types
v1: diameter 0.45, hole 0.25, Top Layer to Bottom Layer, 93 vias
v2: diameter 0.6, hole 0.3, Top Layer to Bottom Layer, 4 vias
v3: diameter 0.8, hole 0.4, Top Layer to Bottom Layer, 7 vias

## Routing (per net, layer and track width the routed paths; a pad name or vN(x,y) marks a point on that pad's centre or on a via; arc(x,y) is an arc through that point)
3V3: length 266.8
  Top Layer w0.305: R11.2 R7.2 ; R18.1 14.26,53.67 R17.1 R16.1
  Top Layer w0.508: v3(35.56,55.12) R8.1 R9.1 ; R7.2 47.88,16.4 47.88,12.08 R4.1 47.86,10.27 47.24,9.65 44.45,9.65 42.54,7.75 38.99,7.75 38.59,8.14 R3.1 ; R16.1 14.34,56.9 v3(15.98,56.9) ; 22.69,22.71 22.69,21.3 22.48,21.08 20.7,21.08 20.32,20.7 U4.16 20.32,18.16 20.7,17.78 22.89,17.78 24.13,16.54 U4.4 v1(24.13,12.19) ; U1.5 18.7,92.18 U1.6 18.7,90.78 U1.7 ; U7.5 2.1,44.64 C10.1 ; CN1.1 v3(28.81,55.12) ; C13.2 43.96,52.82 44.45,52.32 44.45,48.64 43.94,48.13 41.4,48.13 40.74,47.47 U2.2
  Top Layer w0.8: 0.7,27.18 0.7,44.13 1.29,44.72 C10.1 2.17,46.12 3.68,47.62 18.55,47.62 18.54,47.63 ; C14.1 22.86,22.88 22.86,24.51 20.83,26.54 20.83,37.72 19.69,38.86 19.69,46.69 18.75,47.63 18.54,47.63 ; v3(14.86,62.61) 13.35,62.61 R6.1 R5.2 8.25,62.63 7.9,62.99 7.9,67.71 9.91,69.72 14.69,69.72 15.49,70.52 15.49,82.55 16.26,83.31 17.15,83.31 ; U1.7 16.62,90.78 16.26,90.42 16.26,86.74 17.4,85.6 C7.2 ; 0.7,27 0.7,25.4 ; 0.7,25.4 4.81,25.4 R23.1 ; 0.7,25.4 0.7,18.73 1.27,18.16 5.65,18.16 R19.1 ; 18.54,47.63 18.54,54.36 v3(17.78,55.12) ; C13.2 42.8,54.48 42.16,55.12 v3(35.56,55.12)
  Bottom Layer w0.508: v1(24.13,12.19) 26.16,10.16 v2(38.61,10.16)
  Bottom Layer w0.8: v3(35.56,55.12) v3(28.81,55.12) 17.76,55.12 v3(15.98,56.9) 15.98,62.25 15.62,62.61 v3(14.86,62.61)
5V: length 50.4
  Top Layer w0.508: R22.1 v3(17.02,31.24) 16.96,31.3 U6.1 14.73,33.66 12.83,35.56 11.29,35.56 C12.1 11.43,35.96 D1.2 9.62,37.89 R15.2
  Top Layer w0.6: USB1.B4A9 v2(27.4,8.89) ; USB1.A4B9 v2(22.6,8.89)
  Bottom Layer w0.8: v2(27.4,8.89) v2(22.6,8.89) 19.18,8.89 18.67,9.4 18.67,30.61 18.03,31.24 v3(17.02,31.24)
GND: length 44.7
  Top Layer w0.305: C13.1 42.77,50.84 42.51,50.84 40.54,52.82 R14.2 ; C8.1 C9.2
  Top Layer w0.508: C13.1 v2(42.8,49.15) ; USB1.A1B12 21.8,8.68 21.59,8.89 18.16,8.89 ; H1.4 17.11,8.89 18.16,8.89 ; U7.2 3.05,39.24 2.17,38.37 C8.1 ; 18.16,8.89 18.16,5.59 18.92,4.83 30.1,4.83 30.48,5.21 30.48,8.25 29.84,8.89 28.45,8.89 28.2,8.64 USB1.B1A12
  Top Layer w0.8: v3(8.76,24) 8.76,24.76 9.85,25.85 U6.5 ; H1.2 17.02,14.85
  vias: v1(1.38,80.94) v1(1.38,77.27) v1(1.38,62.58) v1(1.4,59.31) v1(2.03,31.75) v1(2.1,33.66) v1(5.59,31.75) v1(6.48,36.07) v1(7.24,37.72) v1(7.87,72.64) v1(8.25,5.46) v1(9.14,95.89) v1(10.41,72.64) v1(11.89,95.89) v1(12.69,72.64) v1(13.48,11.24) v1(13.48,9.33) v1(14.96,95.89) v1(16.76,35.18) v1(16.76,33.2) v1(17.08,5.46) v1(18.92,58.17) v1(21.59,53.47) v1(21.72,93.22) v1(22.71,58.17) v1(23.37,83.19) v1(23.37,79.55) v1(23.37,75.69) v1(23.37,71.75) v1(23.37,68.33) v1(23.37,64.03) v1(24.97,93.22) v1(25.15,47.37) v1(25.4,17.27) v1(26.03,53.47) v1(27.02,17.27) v1(27.31,47.37) v1(27.91,93.22) v1(28.72,34.27) v1(28.72,31.27) v1(28.7,22.99) v1(28.74,17.27) v1(30.99,19.56) v1(31.12,8.89) v1(31.12,5.63) v1(31.12,2.93) v1(31.37,13.97) v1(32.34,22.99) v1(36.83,30.48) v1(37.08,6.73) v1(37.08,3.63) v1(37.59,96.39) v1(38.35,37.08) v1(38.35,34.94) v1(38.35,32.86) v1(38.35,28.45) v1(40.96,96.39) v1(44.32,88.77) v1(44.32,83) v1(44.32,77.27) v1(44.32,72.33) v1(44.32,67.68) v1(44.32,62.93) v1(44.32,56.77) v1(44.58,14.48) v1(46.14,14.48)
VBAT: length 59.9
  Top Layer w0.508: Q3.3 12.48,45.94 13.08,45.34 13.08,39.24 13.83,38.5 R24.1 ; U6.8 14.73,22.13 C11.1
  Top Layer w0.8: R24.1 C15.2 19.18,36.85 19.18,26.67 18.36,25.85 16.89,25.85 ; U6.8 16.89,25.85 ; 16.89,25.85 16.89,18.29 16.09,17.49 8.73,17.49 7.37,16.13 7.37,14.35 5.22,12.2 SW6.2
BAT_ADC: length 26.1
  Top Layer w0.305: R24.2 R25.1 17.4,42.56 C6.2 17.66,42.55 v1(18.79,42.55) ; U2.6 v1(35.66,44.7)
  Bottom Layer w0.305: v1(18.79,42.55) 18.79,43.68 19.81,44.7 v1(35.66,44.7)
BTN0: length 73
  Top Layer w0.305: U2.11 29.31,44.42 31.75,46.86 31.75,56.26 28.07,59.94 12.95,59.94 12.21,59.2 R16.2 C3.2 10.02,58.82 8.76,60.07 7.62,60.07 5.59,62.1 5.59,83.24 SW3.1
BTN1: length 59.4
  Top Layer w0.305: U2.12 28.03,44.67 31.24,47.88 31.24,55.93 27.99,59.18 13.72,59.18 13.26,58.72 13.26,54.77 R17.2 C4.2 10.02,54.69 9.02,55.68 9.02,58.67 8.51,59.18 7.37,59.18 4.83,61.72 4.83,66.42 3.35,67.9 SW4.1
BTN2: length 54.7
  Top Layer w0.305: 10.02,51.78 9.73,52.07 3.3,52.07 2.93,51.69 SW5.1 ; 10.02,51.78 10.03,51.77 10.03,50.95 10.31,50.67 12.18,50.67 R18.2 12.26,49.46 12.57,49.15 15.57,49.15 15.88,49.45 15.88,55.16 18.11,57.4 28.57,57.4 30.61,55.37 30.61,48.39 26.76,44.55 U2.13 ; 10.02,51.78 C5.2
CH340_RX: length 24.4
  Top Layer w0.305: U2.35 38.23,24.97 v1(38.23,23.5) ; v1(22.86,15.49) U4.3
  Bottom Layer w0.305: v1(22.86,15.49) 34.29,15.49 38.23,19.43 v1(38.23,23.5)
CH340_TX: length 24.4
  Top Layer w0.305: v1(21.97,16) 21.59,15.62 U4.2 ; U2.34 v1(36.93,23.5)
  Bottom Layer w0.305: v1(36.93,23.5) 36.93,19.53 33.66,16.26 22.22,16.26 v1(21.97,16)
CHG#: length 54
  Top Layer w0.305: v1(31.84,41.15) U2.9 31.84,44.8 35.56,48.51 R8.2 ; U6.3 v1(12.19,33.22) 12.14,33.27 9.65,33.27 8.76,32.39 8.76,26.47 6.25,23.95 3.73,23.95 3.43,23.65 3.43,21.98
  Bottom Layer w0.305: v1(31.84,41.15) 31.52,40.82 20.24,40.82 12.7,33.27 12.24,33.27 v1(12.19,33.22)
DTR: length 21.6
  Top Layer w0.305: U4.13 24.13,20.45 24.99,21.31 35.8,21.31 37.47,19.64 37.47,16.89 37.97,16.38 R1.1 38.66,16.58 Q2.2
DW1000_CSN: length 83.6
  Top Layer w0.305: v1(29.31,27.19) 29.31,25.01 U2.28 ; U1.17 v1(37.08,89.39)
  Bottom Layer w0.305: v1(37.08,89.39) 37.08,64.77 41.53,60.33 41.53,28.21 40.51,27.19 v1(29.31,27.19)
DW1000_IRQ: length 85.1
  Top Layer w0.305: v1(26.92,28.83) 26.92,25.16 U2.26 ; U1.22 v1(33.78,96.37)
  Bottom Layer w0.305: v1(26.92,28.83) 26.92,37.08 29.21,39.37 36.58,39.37 38.61,41.4 38.61,59.56 33.78,64.39 v1(33.78,96.37)
DW1000_MISO: length 78
  Top Layer w0.305: v1(33.13,28.57) 33.13,25.02 U2.31 ; U1.19 v1(35.51,92.18)
  Bottom Layer w0.305: v1(35.51,92.18) 35.51,64.57 40,60.07 40,41.02 37.08,38.1 33.91,38.1 33.13,37.33 v1(33.13,28.57)
DW1000_MOSI: length 72.7
  Top Layer w0.305: U1.18 v1(36.32,90.78) ; U2.37 40.77,25.03 v1(40.77,30.61)
  Bottom Layer w0.305: v1(40.77,30.61) 40.77,60.14 36.32,64.58 v1(36.32,90.78)
DW1000_RSTN: length 98.1
  Top Layer w0.305: U2.27 28.07,25.03 v1(28.07,26.92) ; U1.3 v1(20.85,96.38)
  Bottom Layer w0.305: v1(28.07,26.92) 28.07,27.38 27.73,27.72 26.77,27.72 25.91,28.57 25.91,37.21 28.7,40 36.19,40 37.85,41.66 37.85,59.31 33.02,64.14 33.02,95.63 32.28,96.38 v1(20.85,96.38)
DW1000_SCK: length 79.2
  Top Layer w0.305: U1.20 v1(34.67,93.58) ; U2.30 31.84,25.01 v1(31.84,28.63)
  Bottom Layer w0.305: v1(31.84,28.63) 31.84,37.45 33.13,38.73 36.83,38.73 39.37,41.28 39.37,59.82 34.67,64.52 v1(34.67,93.58)
EN: length 44.6
  Top Layer w0.305: U2.3 39.47,41.18 v1(42.16,38.48) ; SW1.2 34.15,9.51 C1.2 ; C1.2 R3.2 ; C1.2 v1(34.15,14.24) 32.15,16.24 Q1.3
  Bottom Layer w0.305: v1(34.15,14.24) 42.16,22.26 v1(42.16,38.48)
EN_CHG#: length 12.4
  Top Layer w0.305: R13.1 37.96,52.83 37.08,52.83 36.78,52.53 36.78,48.59 33.12,44.93 U2.8
I2C_SCL: length 48.5
  Top Layer w0.305: CN1.3 23.73,42.56 24.64,41.66 25.65,41.66 26.54,40.77 26.54,39.75 31.12,35.18 31.12,32.51 31.75,31.88 38.23,31.88 39.47,30.64 U2.36 39.5,24.97 39.5,23.62 39.71,23.41 41.49,23.41 44.07,20.83 47.16,20.83 47.62,20.37 R7.1
I2C_SDA: length 48.9
  Top Layer w0.305: CN1.4 21.19,42.06 22.35,40.89 25.27,40.89 26.03,40.13 26.03,39.24 30.56,34.72 30.56,32.16 31.48,31.24 35.05,31.24 35.56,30.73 35.56,25.09 U2.33 35.66,23.37 36.29,22.73 41.32,22.73 43.78,20.28 45.02,20.28 45.47,19.84 R11.1
IO0: length 36.8
  Top Layer w0.305: U2.25 25.5,23.4 26.8,22.1 41.08,22.1 42.53,20.65 Q2.3 42.53,14.75 43.18,14.1 43.18,12.08 C2.2 ; C2.2 43.05,11.95 43.05,9.91 42.51,9.37 SW2.2 ; C2.2 R4.2
PPR#: length 47.5
  Top Layer w0.305: R9.2 33.15,46.99 30.57,44.42 U2.10 v1(30.57,41.53) ; LED2.2 3.3,32.13 5.46,34.29 v1(12.57,34.29) 13.46,33.4 U6.2
  Bottom Layer w0.305: v1(12.57,34.29) 12.57,34.8 19.3,41.53 v1(30.57,41.53)
RTS: length 15.1
  Top Layer w0.305: U4.14 22.86,18.67 23.5,18.03 29.97,18.03 30.3,18.36 34.34,18.36 34.35,18.35 ; 34.35,18.35 35.11,18.35 35.43,18.67 R2.1 ; 34.35,18.35 Q1.2
USB_D+: length 17.3
  Top Layer w0.305: USB1.B6 25.75,10.51 26.42,11.18 26.42,11.56 27.31,12.45 27.31,14.6 26.8,15.11 25.71,15.11 25.4,14.81 U4.5 25.4,11.68 24.75,11.03 USB1.A6
USB_D-: length 9.9
  Top Layer w0.305: USB1.B7 24.25,6.61 24.51,6.35 25.04,6.35 25.25,6.56 USB1.A7 25.25,10.77 25.91,11.43 25.91,11.94 26.67,12.7 U4.6
VSYS: length 24.2
  Top Layer w0.508: U7.1 2.1,41.13 2.49,41.53 3.52,41.53 4,41.05 U7.3 4,38.02 5.64,38.02 6.22,38.61 6.22,43.69 7.37,44.83 9.62,44.83 10.98,43.47 10.98,42.86 11.43,42.42 D1.1 ; C9.1 C8.2
$1N1272: length 2.3
  Top Layer w0.305: Q1.1 36.4,16.45 R1.2
$1N1274: length 2.1
  Top Layer w0.305: Q2.1 38.66,18.48 R2.2
$1N2137: length 4
  Top Layer w0.305: R20.2 23.24,10.54 23.75,10.03 USB1.A5
$1N2147: length 4.2
  Top Layer w0.305: R21.2 26.59,10.54 26.29,10.24 26.29,8.89 26.75,8.43 USB1.B5
$1N2753: length 30
  Top Layer w0.305: U1.9 20.1,69.76 18.03,67.69 11.68,67.69 10.16,66.17 R5.1
$1N2758: length 28.5
  Top Layer w0.305: U1.10 21.5,69.76 18.67,66.93 13.64,66.93 13.34,66.62 R6.2
$1N3652: length 3
  Top Layer w0.508: R15.1 9.08,40.56 Q3.1
$1N4219: length 4.3
  Top Layer w0.305: R10.1 12.95,23.37 13.46,23.88 U6.7
$1N4263: length 4.7
  Top Layer w0.305: R12.1 10.67,23.11 12.19,24.64 U6.6
$1N4572: length 4.9
  Top Layer w0.305: R23.2 6.46,29.83 4.23,27.6 LED2.1
$1N4597: length 4.8
  Top Layer w0.305: R19.2 6.64,21.88 4.54,19.78 3.43,19.78
$1N4717: length 42.3
  Top Layer w0.305: v1(36.05,46.54) 37.97,48.47 R13.2 40.37,50.82 40.38,50.82 R14.1 ; U6.4 v1(10.92,32.64)
  Bottom Layer w0.305: v1(36.05,46.54) 34.85,45.34 19.18,45.34 10.92,37.08 v1(10.92,32.64)
$1N5038: length 11.5
  Top Layer w0.8: SW6.3 7.02,10.7 9.02,12.7 9.02,14.35 9.58,14.92 12.43,14.92 H1.1

## Copper pours and planes (outline as drawn; the poured copper is in the pictures)
GND on Top Layer: -3.43,102.74 53.21,102.74 53.21,-2.92 -3.43,-2.92
GND on Bottom Layer: -9.53,107.19 58.42,107.19 58.42,-1.14 -9.53,-1.14

## Text on the board
Bottom Silkscreen Layer: 50MM | 42MM | R4 | 11MM | 92MM | 100MM | 13MM | 39MM | 12MM | 18MM
Top Silkscreen Layer: EN | IO0 | PPR | CHG | + - | UP | OK | DOWN | ON/OFF | ESP32_DWM1000_V1
